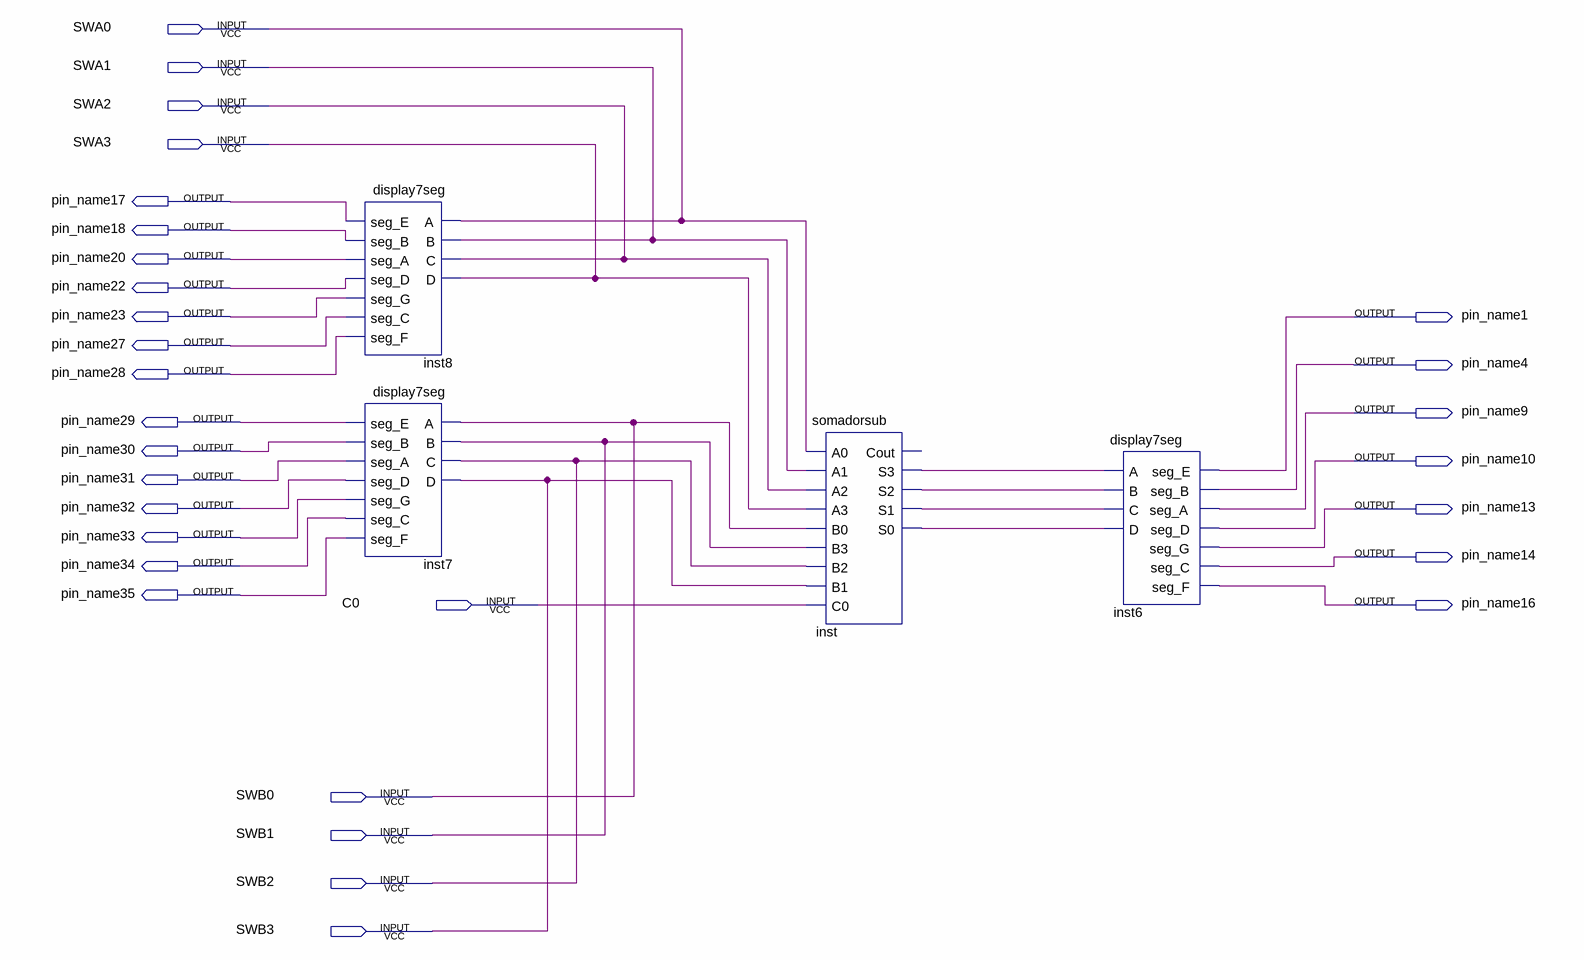
[diagram p0: schematic sheet]
// Quartus schematic somadorsub4dig.bdf as structural Verilog: 4 symbols, 30 pins
module somadorsub4dig (
  input  SWA0,
  input  SWA1,
  input  SWA2,
  input  SWA3,
  input  C0,
  input  SWB0,
  input  SWB1,
  input  SWB2,
  input  SWB3,
  output pin_name17,
  output pin_name18,
  output pin_name20,
  output pin_name22,
  output pin_name23,
  output pin_name1,
  output pin_name27,
  output pin_name4,
  output pin_name28,
  output pin_name9,
  output pin_name29,
  output pin_name30,
  output pin_name10,
  output pin_name31,
  output pin_name32,
  output pin_name13,
  output pin_name33,
  output pin_name14,
  output pin_name34,
  output pin_name35,
  output pin_name16
);

  wire inst_s0, inst_s1, inst_s2, inst_s3;

  display7seg inst8 (
    .A(SWA0), .B(SWA1), .C(SWA2), .D(SWA3), .seg_E(pin_name17), .seg_B(pin_name18), .seg_A(pin_name20),
    .seg_D(pin_name22), .seg_G(pin_name23), .seg_C(pin_name27), .seg_F(pin_name28));
  display7seg inst7 (
    .A(SWB0), .B(SWB1), .C(SWB2), .D(SWB3), .seg_E(pin_name29), .seg_B(pin_name30), .seg_A(pin_name31),
    .seg_D(pin_name32), .seg_G(pin_name33), .seg_C(pin_name34), .seg_F(pin_name35));
  somadorsub inst (
    .A0(SWA0), .A1(SWA1), .A2(SWA2), .A3(SWA3), .B0(SWB0), .B3(SWB1), .B2(SWB2), .B1(SWB3), .C0(C0),
    .S3(inst_s3), .S2(inst_s2), .S1(inst_s1), .S0(inst_s0));  // open: Cout
  display7seg inst6 (
    .A(inst_s3), .B(inst_s2), .C(inst_s1), .D(inst_s0), .seg_E(pin_name1), .seg_B(pin_name4),
    .seg_A(pin_name9), .seg_D(pin_name10), .seg_G(pin_name13), .seg_C(pin_name14), .seg_F(pin_name16));
endmodule
